# Altium schematic sheet Placa 2.SchDoc
size A
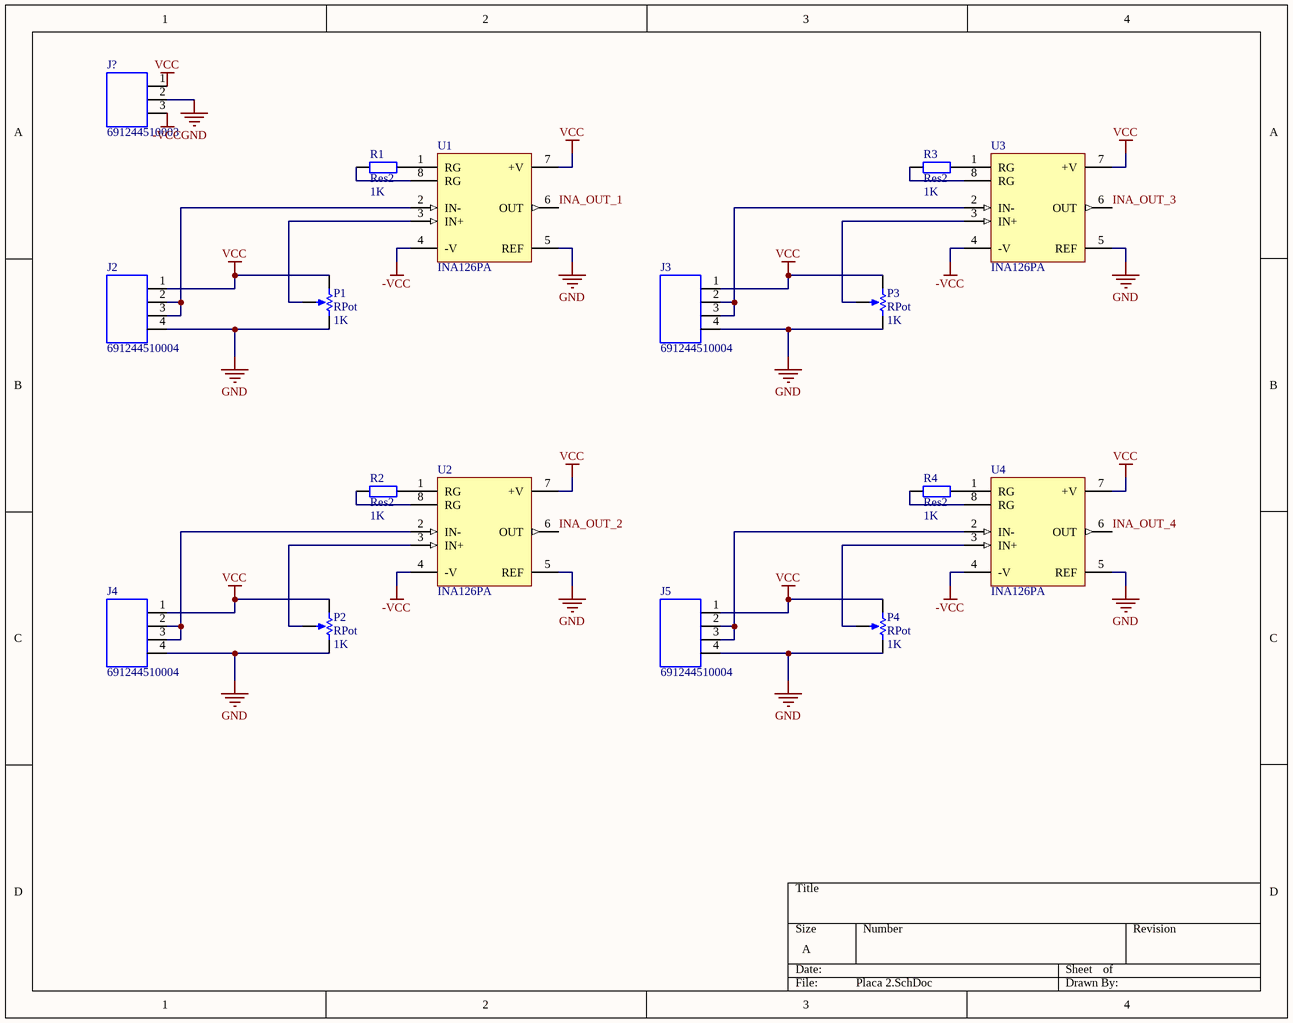
[diagram p0: Placa 2.SchDoc]

## Parts
J2  691244510004  [691244510004]
J3  691244510004  [691244510004]
J4  691244510004  [691244510004]
J5  691244510004  [691244510004]
J?  691244510003  [691244510003]
P1  RPot  value 1K  [VR5]
P2  RPot  value 1K  [VR5]
P3  RPot  value 1K  [VR5]
P4  RPot  value 1K  [VR5]
R1  Res2  value 1K  [AXIAL-0.4]
R2  Res2  value 1K  [AXIAL-0.4]
R3  Res2  value 1K  [AXIAL-0.4]
R4  Res2  value 1K  [AXIAL-0.4]
U1  INA126PA  [006E]
U2  INA126PA  [006E]
U3  INA126PA  [006E]
U4  INA126PA  [006E]

## Nets
-VCC: J?.3 U1.4(-V) U2.4(-V) U3.4(-V) U4.4(-V)
GND: J2.4 J3.4 J4.4 J5.4 J?.2 P1.2(BOT) P2.2(BOT) P3.2(BOT) P4.2(BOT) U1.5(REF) U2.5(REF) U3.5(REF) U4.5(REF)
VCC: J2.1 J3.1 J4.1 J5.1 J?.1 P1.1(TOP) P2.1(TOP) P3.1(TOP) P4.1(TOP) U1.7(+V) U2.7(+V) U3.7(+V) U4.7(+V)
INA_OUT_1: U1.6(OUT)
INA_OUT_2: U2.6(OUT)
INA_OUT_3: U3.6(OUT)
INA_OUT_4: U4.6(OUT)
NetJ2_2: J2.2 J2.3 U1.2(IN-)
NetJ3_2: J3.2 J3.3 U3.2(IN-)
NetJ4_2: J4.2 J4.3 U2.2(IN-)
NetJ5_2: J5.2 J5.3 U4.2(IN-)
NetP1_3: P1.3(TAP) U1.3(IN+)
NetP2_3: P2.3(TAP) U2.3(IN+)
NetP3_3: P3.3(TAP) U3.3(IN+)
NetP4_3: P4.3(TAP) U4.3(IN+)
NetR1_1: R1.1 U1.8(RG)
NetR1_2: R1.2 U1.1(RG)
NetR2_1: R2.1 U2.8(RG)
NetR2_2: R2.2 U2.1(RG)
NetR3_1: R3.1 U3.8(RG)
NetR3_2: R3.2 U3.1(RG)
NetR4_1: R4.1 U4.8(RG)
NetR4_2: R4.2 U4.1(RG)

## Library data of the parts
J2-J5 = 691244510004: WR-TBL Horizontal Cable Entry With Rising Cage Clamp,Serie 2445 - 5.08 mm; Manufacturer: Wurth Elektronik; ComponentLink1 Description: Manufacturer; ComponentLink2 Description: Datasheet; ComponentLink1URL: http://www.we-online.de; ComponentLink2URL: http://katalog.we-online.de/em/datasheet/6912445100XX.pdf; Created by: Baojun Chen; Created Date: 15.Sep.2015; partNo: 691244510004
J? = 691244510003: WR-TBL Horizontal Cable Entry With Rising Cage Clamp,Serie 2445 - 5.08 mm; Manufacturer: Wurth Elektronik; ComponentLink1 Description: Manufacturer; ComponentLink2 Description: Datasheet; ComponentLink1URL: http://www.we-online.de; ComponentLink2URL: http://katalog.we-online.de/em/datasheet/6912445100XX.pdf; Created by: Baojun Chen; Created Date: 15.Sep.2015; partNo: 691244510003
P1-P4 = RPot: Potentiometer; Sim Note: Enter the Resistance value and the set point into parameter fields.; Set Position: 0.5; Published: 8-Jun-2000; LatestRevisionDate: 17-Jul-2002; LatestRevisionNote: Re-released for DXP Platform.; PackageReference: VR5; Publisher: Altium Limited; PackageDescription: Variable Resistor, Thru-Hole; 3 Leads
R1-R4 = Res2: Resistor; Published: 8-Jun-2000; LatestRevisionDate: 17-Jul-2002; LatestRevisionNote: Re-released for DXP Platform.; PackageReference: AXIAL-0.4; Publisher: Altium Limited; PackageDescription: Axial Device, Thru-Hole; 2 Leads; 0.4 in Pin Spacing
U1-U4 = INA126PA: Precision, Low-Power Instrumentation Amplifiers; Published: 8-Jun-2000; LatestRevisionDate: 06-Jun-2005; LatestRevisionNote: Stylized 3D Model Added.; DatasheetVersion: Oct-1996; PackageVersion: revE; PackageReference: 006E; Publisher: Altium Limited; PackageDescription: DIP; 8 Leads; Row Spacing 7.62 mm; Pitch 2.54 mm; ComponentLink1Description: Manufacturer Link; ComponentLink1URL: http://www.ti.com/; ComponentLink2Description: Datasheet; ComponentLink2URL: http://www-s.ti.com/sc/ds/INA128.pdf